# EAGLE design latch3 (EAGLE 8.3.1)
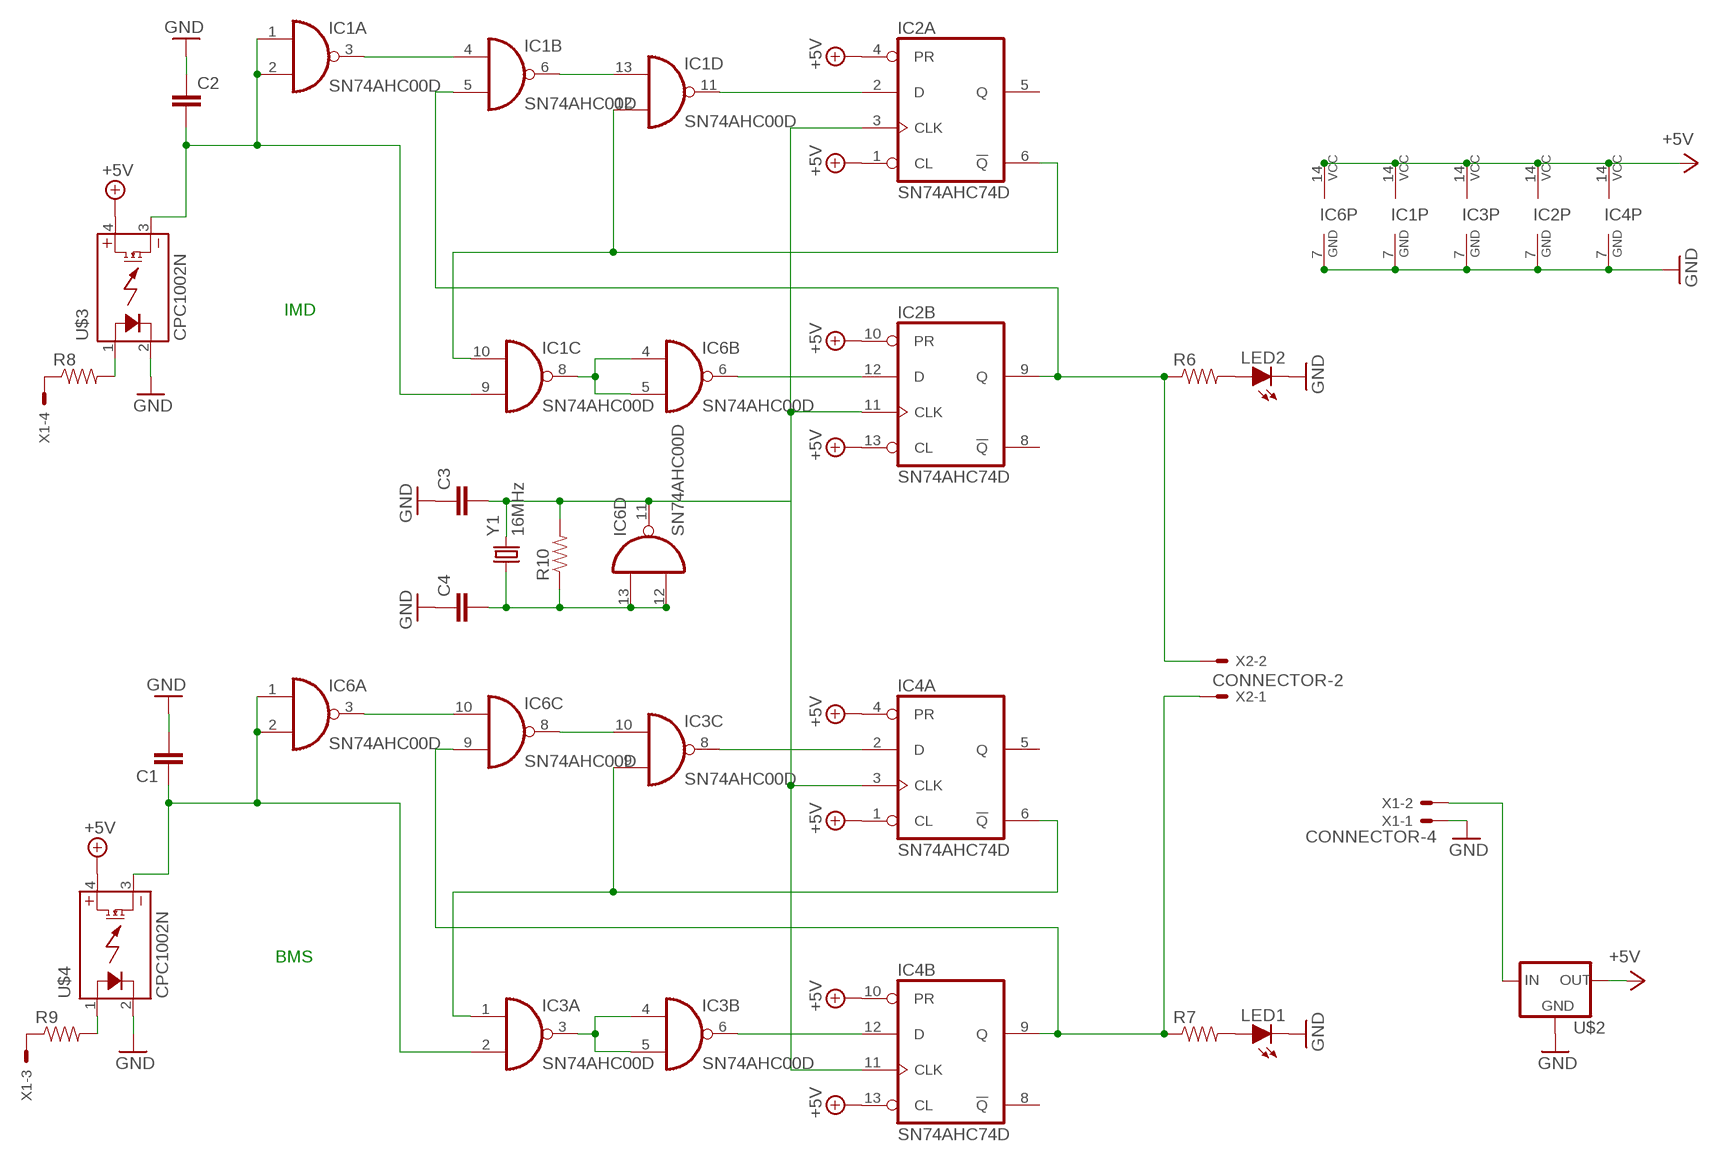
[diagram p0: schematic, sheet 1]

## Parts
C1  CAP0402-CAP  [0402-CAP]
C2  CAP0402-CAP  [0402-CAP]
C3  CAP0402-CAP  [0402-CAP]
C4  CAP0402-CAP  [0402-CAP]
IC1  SN74AHC00D  [SOIC-14]
IC2  SN74AHC74D  [SOIC-14]
IC3  SN74AHC00D  [SOIC-14]
IC4  SN74AHC74D  [SOIC-14]
IC6  SN74AHC00D  [SOIC-14]
LED1  LED-0805  [LED-805]
LED2  LED-0805  [LED-805]
R6  RESISTOR0402  [0402-RES]
R7  RESISTOR0402  [0402-RES]
R8  RESISTOR0402  [0402-RES]
R9  RESISTOR0402  [0402-RES]
R10  RESISTOR0402  [0402-RES]
U$2  5VREG_LM340-NLM340MPX-5.0/NOPB  [SOT223]
U$3  CPC1002N  [SOP04]
U$4  CPC1002N  [SOP04]
X1  CONNECTOR-4  [MINIFIT_5566-4]
X2  CONNECTOR-2  [MINIFIT_5566-2]
Y1  16MHz  CRYSTAL3.2X1.5MM  [CRYSTAL-SMD-3.2X1.5MM]

## Nets
12V: U$2.1(IN) X1.2
+5V: IC1.14(P:VCC) IC2.1(A:CL) IC2.4(A:PR) IC2.10(B:PR) IC2.13(B:CL) IC2.14(P:VCC) IC3.14(P:VCC) IC4.1(A:CL) IC4.4(A:PR) IC4.10(B:PR) IC4.13(B:CL) IC4.14(P:VCC) IC6.14(P:VCC) U$2.3(OUT) U$3.4(DC+) U$4.4(DC+)
BMS_5V: C1.1 IC3.2(A:I1) IC6.1(A:I0) IC6.2(A:I1) U$4.3(DC-)
BMS_IN: R9.2 U$4.1(CONTROL+)
BMS_OUT: IC4.9(B:Q) IC6.9(C:I1) R7.1 X2.1
GND: C1.2 C2.1 C3.1 C4.1 IC1.7(P:GND) IC2.7(P:GND) IC3.7(P:GND) IC4.7(P:GND) IC6.7(P:GND) LED1.C LED2.C U$2.2(GND) U$2.4(GND) U$3.2(CONTROL-) U$4.2(CONTROL-) X1.1
IMD_5V: C2.2 IC1.1(A:I0) IC1.2(A:I1) IC1.9(C:I1) U$3.3(DC-)
IMD_IN: R8.2 U$3.1(CONTROL+)
IMD_OUT: IC1.5(B:I1) IC2.9(B:Q) R6.1 X2.2
N$2: IC1.3(A:O) IC1.4(B:I0)
N$4: IC1.6(B:O) IC1.13(D:I0)
N$5: IC1.10(C:I0) IC1.12(D:I1) IC2.6(A:!Q)
N$6: IC1.11(D:O) IC2.2(A:D)
N$7: C3.2 IC2.3(A:CLK) IC2.11(B:CLK) IC4.3(A:CLK) IC4.11(B:CLK) IC6.11(D:O) R10.2 Y1.P$2
N$8: IC2.12(B:D) IC6.6(B:O)
N$10: IC3.6(B:O) IC4.12(B:D)
N$11: IC1.8(C:O) IC6.4(B:I0) IC6.5(B:I1)
N$12: C4.2 IC6.12(D:I1) IC6.13(D:I0) R10.1 Y1.P$1
N$20: IC6.3(A:O) IC6.10(C:I0)
N$21: IC3.10(C:I0) IC6.8(C:O)
N$22: IC3.1(A:I0) IC3.9(C:I1) IC4.6(A:!Q)
N$23: IC3.8(C:O) IC4.2(A:D)
N$25: IC3.3(A:O) IC3.4(B:I0) IC3.5(B:I1)
N$29: LED1.A R7.2
N$30: LED2.A R6.2
N$32: R8.1 X1.4
N$33: R9.1 X1.3
Unconnected: IC2.5(A:Q) IC2.8(B:!Q) IC3.11(D:O) IC3.12(D:I1) IC3.13(D:I0) IC4.5(A:Q) IC4.8(B:!Q)

## Notes on the sheet
- IMD
- BMS

## Library data of the parts
C1-C4 = HyTechDevices:CAP: Capacitor Standard 0603 ceramic capacitor, and 0.1" leaded capacitor.
IC1 IC3 IC6 = HyTechDevices:SN74AHC00: TI SN74AHC00 Quadruple 2-input NAND
IC2 IC4 = HyTechDevices:SN74AHC74: TI SN74AHC74 Dual positive edge triggered D-type FLIP FLOP
LED1 LED2 = HyTechDevices:LED: Light Emitting Diode (LED) Source: Dangerous Prototypes Eagle Library <https://github.com/DangerousPrototypes/Eagle_Part_Library>
R6-R10 = HyTechDevices:RESISTOR: Resistor Basic schematic elements and footprints for 0603, 1206, and PTH resistors.
U$2 = HyTechDevices:5VREG_LM340-N: Voltage Regulator 5v linear voltage regulator Datasheet <http://www.mouser.com/ProductDetail/Texas-Instruments/LM340MPX-50-NOPB/?qs=X1J7HmVL2ZGZwtTFRQ9ItA%3D%3D> MAX current out: 1.5A MAX voltage in: 35V
U$3 U$4 = HyTechDevices:CPC1002N: IXYS Solid State Relay .7A
X1 = HyTechDevices:CONNECTOR-4: Mini-Fit Junior connector 4 pole Source: http://www.molex.com; OC_FARNELL: unknown; OC_NEWARK: unknown
X2 = HyTechDevices:CONNECTOR-2: Mini-Fit Junior connector 2 pole Source: http://www.molex.com; OC_FARNELL: 1822072; OC_NEWARK: unknown
Y1 = HyTechDevices:CRYSTAL: Various standard crystals. Proven footprints. Source: Sparkfun <https://github.com/sparkfun/SparkFun-Eagle-Libraries>; PROD_ID: XTAL-13062; VALUE: 32.768kHz

## Board
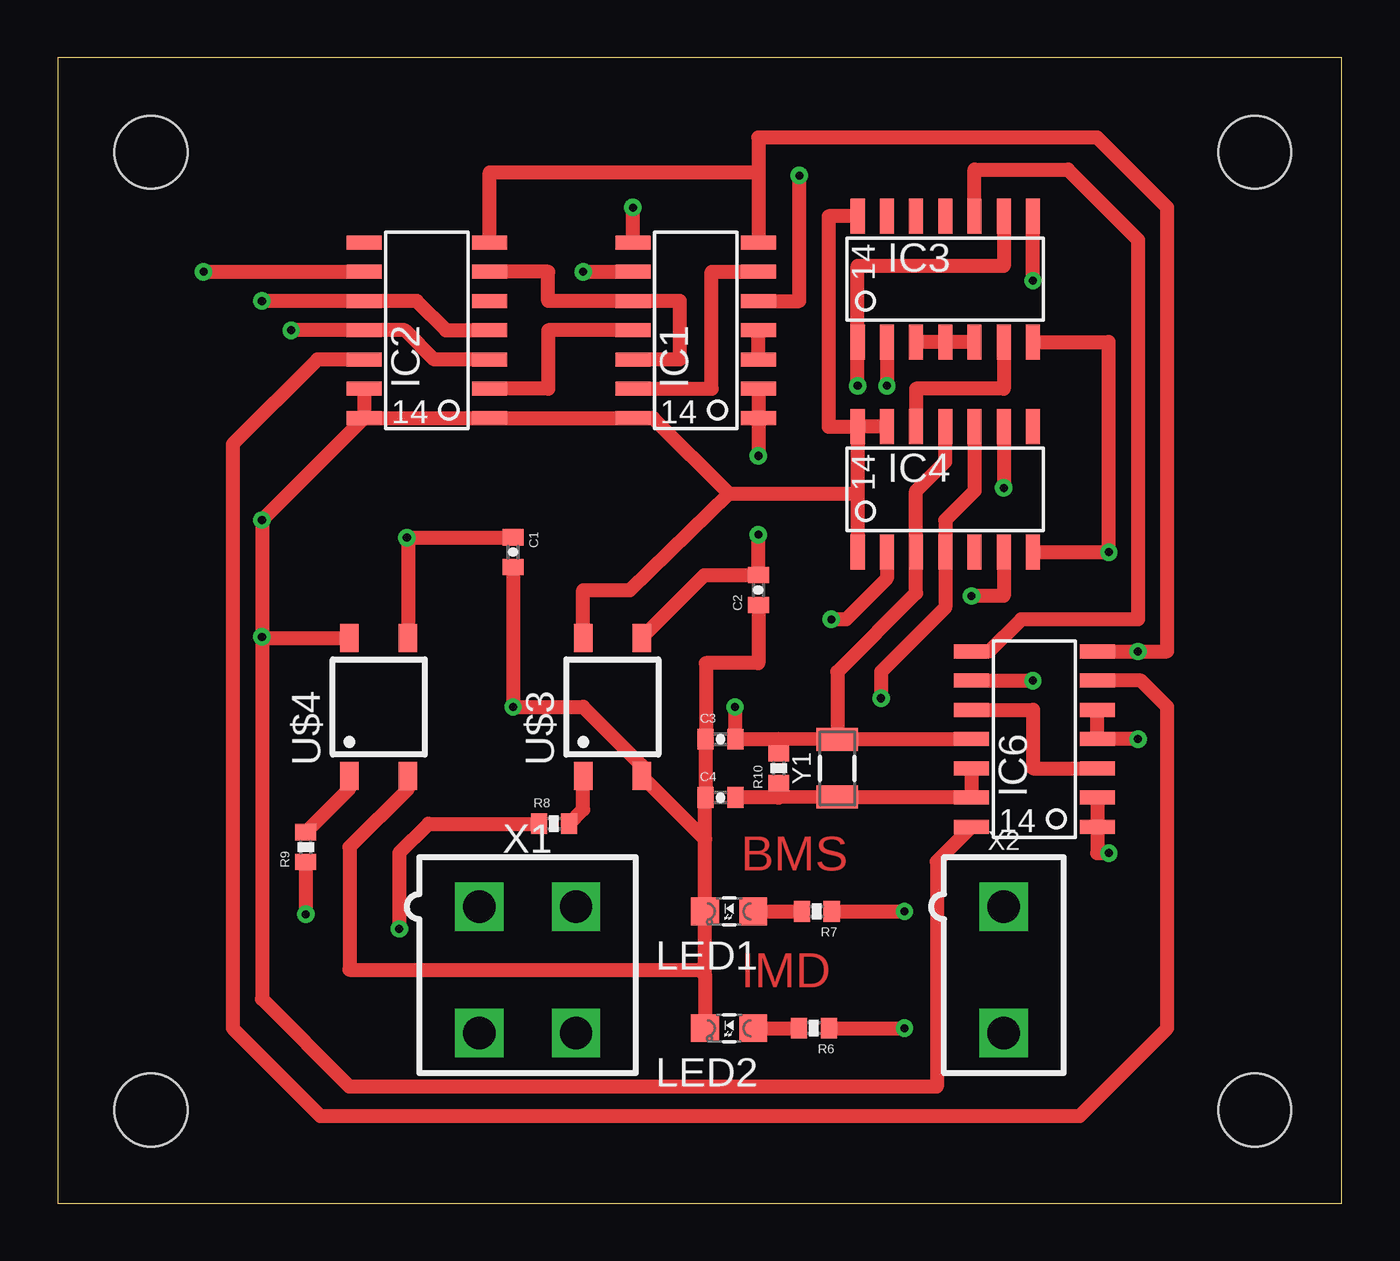
[diagram p1: board, top side]
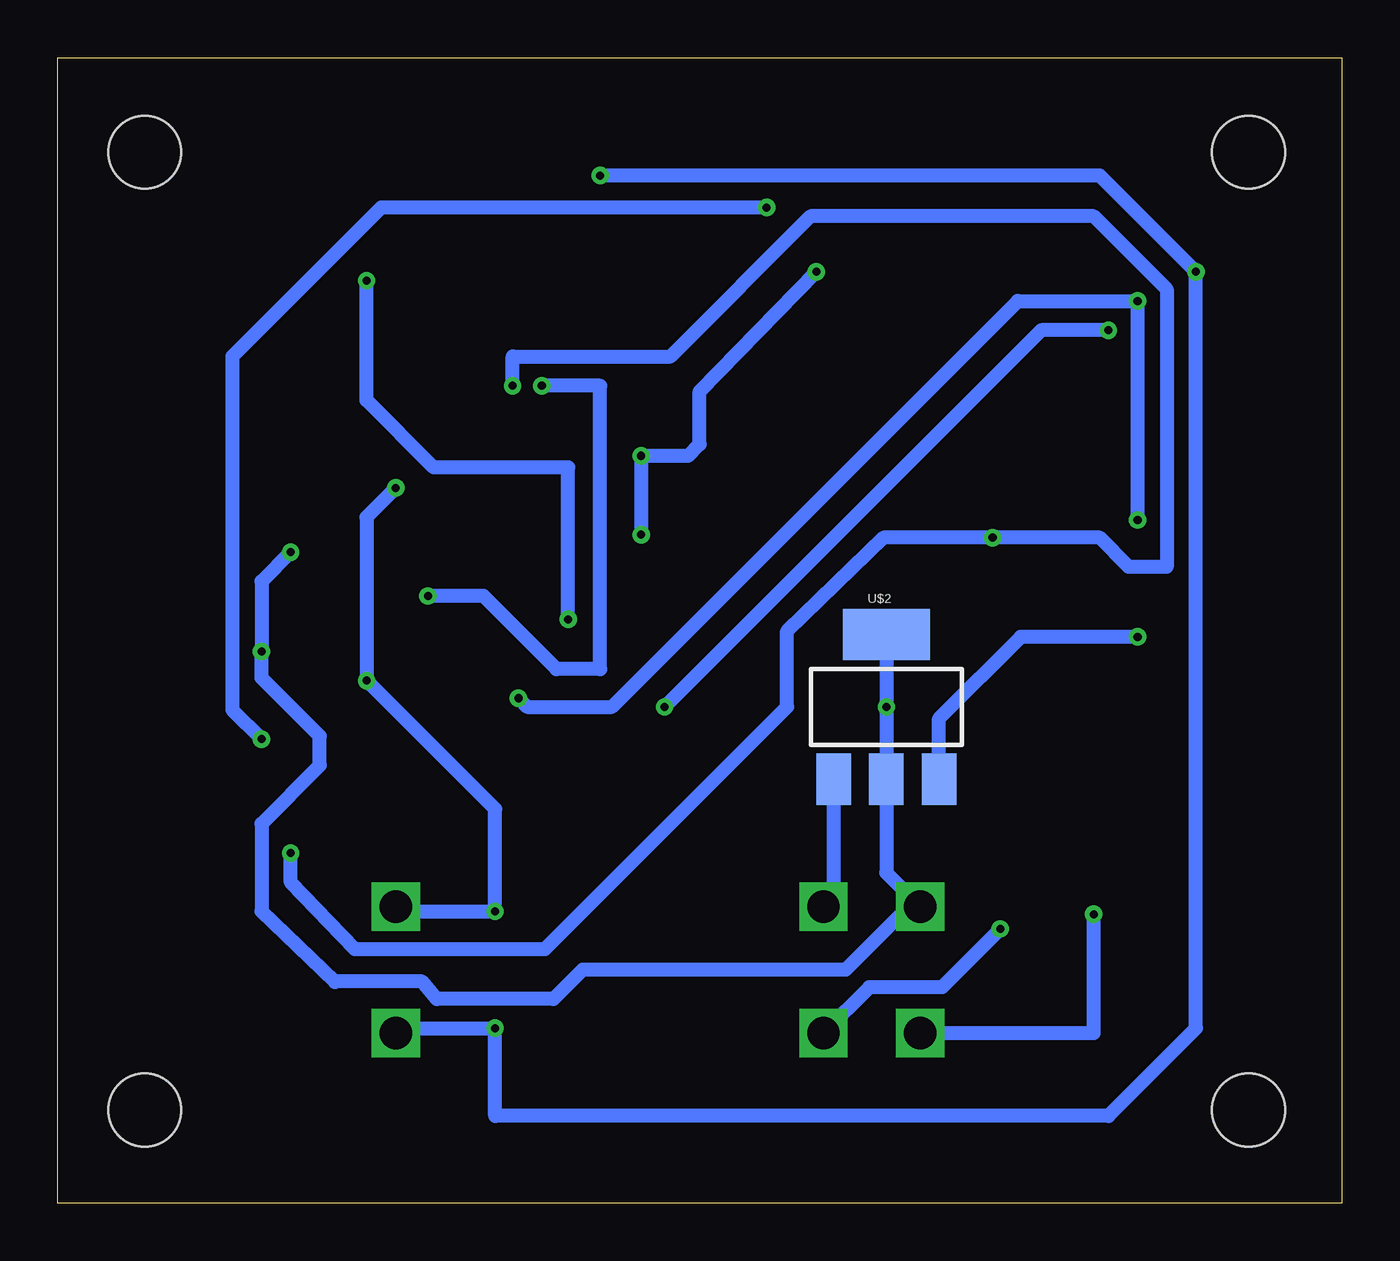
[diagram p2: board, bottom side, seen from below]

Size 55.86 x 49.84 mm. Coordinates in mm from the lower left corner, seen from the top.
Outline: 0,0 55.86,0 55.86,49.84 0,49.84 0,0
Copper layers (1*16): Top 0.035mm / dielectric 1.5mm / Bottom 0.035mm
Design rules "default *": minimum track width 6mil, minimum drill 0.35mm, track to track 16mil, track to pad 16mil, pad to pad 16mil, via to via 16mil, smd to smd 16mil, copper to edge 40mil, drill to drill 6mil, minimum pad ring 10mil, minimum via ring 8mil, stop-mask expansion 4mil, vias tented up to drill 0mil, thermal gap 10mil
Holes 3.17 mm at 4.06,4.06 4.06,45.72 52.07,45.72 52.07,4.06

### Footprints (pad centres in the part's own frame; a part is rotated, then mirrored left to right if it is on the bottom)
0402-CAP = smd 0.7 x 0.9: 1 -0.65,0; 2 0.65,0
SOIC-14 = smd 0.61 x 1.524: 1 -4.445,-2.794; 2 -3.175,-2.794; 3 -1.905,-2.794; 4 -0.635,-2.794; 5 0.635,-2.794; 6 1.905,-2.794; 7 3.175,-2.794; 8 3.175,2.667; 9 1.905,2.667; 10 0.635,2.667; 11 -0.635,2.667; 12 -1.905,2.667; 13 -3.175,2.667; 14 -4.445,2.667
LED-805 = smd 1.2 x 1.2: A 0,-1.05; C 0,1.05
0402-RES = smd 0.7 x 0.9: 1 -0.65,0; 2 0.65,0
SOT223 = smd 1.5 x 2.235: 1 -2.3,-3.15; 2 0,-3.15; 3 2.3,-3.15 | smd 3.8 x 2.2: 4 0,3.15
SOP04 = smd 0.8 x 1.2: 1 -1.27,-3; 2 1.27,-3; 3 1.27,3; 4 -1.27,3
MINIFIT_5566-4 = drill 1.4 square: 1 2.1,-2.75; 2 -2.1,-2.75; 3 2.1,2.75; 4 -2.1,2.75
MINIFIT_5566-2 = drill 1.4 square: 1 0,-2.75; 2 0,2.75
CRYSTAL-SMD-3.2X1.5MM = smd 1 x 1.8: P$1 -1.25,0; P$2 1.25,0

### Placement (x,y rotation side)
C1  19.81,28.32 270 top
C2  30.48,26.67 90 top
C3  28.83,20.19 0 top
C4  28.83,17.65 0 top
IC1  27.69,38.61 90 top
IC2  16,38.61 90 top
IC3  39.24,40.26 0 top
IC4  39.24,31.11 0 top
IC6  42.42,20.83 90 top
LED1  29.21,12.7 90 top
LED2  29.21,7.62 90 top
R6  32.89,7.62 180 top
R7  33.02,12.7 180 top
R8  21.59,16.51 0 top
R9  10.79,15.49 90 top
R10  31.37,18.92 90 top
U$2  19.81,21.59 0 bottom
U$3  24.13,21.59 0 top
U$4  13.97,21.59 0 top
X1  20.45,10.16 180 top
X2  41.15,10.16 180 top
Y1  33.91,18.92 90 top

### Tracks (layer width: path | path; a pad name or v marks a point on that pad's centre or on a via)
12V
  Bottom 0.61: U$2.1 22.11,13.35 X1.2
+5V  (via drill 0.35)
  Top 0.61: 8.89,24.59 U$4.4 | 8.89,24.59 v8.89,24.64 v8.89,29.72 IC2.14 | 22.81,24.64 U$3.4 22.86,26.67 24.89,26.67 29.21,30.86 | IC4.13 IC4.14 | IC2.13 IC2.14 | IC2.4 16.89,37.97 15.62,39.24 IC2.10 v8.89,39.24 | IC2.14 IC2.1 IC1.14 25.91,34.16 29.21,30.86 | IC3.14 33.53,42.93 33.53,33.78 IC4.14 | IC4.10 39.88,30.99 38.61,29.72 IC4.4 38.61,25.91 35.81,23.11 v35.81,21.97 | 8.89,24.59 8.89,8.89 12.7,5.08 38.24,5.08 38.24,14.87 IC6.14 | IC4.14 34.8,30.86 | 34.8,30.86 IC4.1 | 29.21,30.86 34.8,30.86
  Bottom 0.61: v8.89,24.64 13.97,24.64 17.53,21.08 17.53,18.45 U$2.3 | v8.89,29.72 v8.89,39.24 14.1,39.24 31.75,21.59 35.43,21.59 v35.81,21.97
BMS_5V  (via drill 0.35)
  Top 0.61: IC3.2 v36.07,35.56 | IC6.2 IC6.1 45.21,15.24 v45.72,15.24 | v15.19,28.96 15.22,28.96 15.24,28.94 | 15.24,28.94 U$4.3 | C1.1 19.78,28.94 15.24,28.94
  Bottom 0.61: v45.72,15.24 45.72,13.97 42.93,11.05 34.67,11.05 24.13,21.59 24.13,24.89 19.94,28.96 v15.19,28.96 10.54,28.96 9.27,27.69 7.62,27.69 7.62,39.75 10.79,42.93 23.11,42.93 29.21,36.83 36.07,36.83 v36.07,35.56
BMS_IN
  Top 0.61: U$4.1 12.7,18.05 R9.2
BMS_OUT  (via drill 0.35)
  Top 0.61: R7.1 v36.83,12.7 | IC4.9 v41.15,31.11 | IC6.9 v42.42,22.73
  Bottom 0.61: X2.1 40.94,12.7 v36.83,12.7 36.83,17.14 v42.42,22.73 42.42,29.84 v41.15,31.11
GND  (via drill 0.35)
  Top 0.61: 28.16,9.92 LED1.C 28.16,15.83 | 28.16,9.92 LED2.C | 28.16,15.83 U$3.2 25.4,19.05 22.86,21.59 v19.81,21.59 C1.2 | 28.18,17.67 C3.1 28.19,20.19 28.19,23.5 30.48,23.5 C2.1 | 28.18,17.67 C4.1 | 28.16,15.83 28.16,17.53 28.18,17.67 | U$4.2 15.24,18.03 12.7,15.49 12.7,10.16 27.92,10.16 28.16,9.92 | IC3.7 45.72,37.47 v45.72,28.32 IC4.7 | IC6.7 v46.99,24 48.26,24 48.26,43.31 45.21,46.35 30.48,46.35 30.48,44.83 | IC2.7 18.8,44.83 30.48,44.83 | 30.48,44.83 IC1.7
  Bottom 0.61: U$2.4 v19.81,21.59 U$2.2 19.81,14.38 X1.1 18.84,12.91 21.59,10.16 33.02,10.16 34.29,8.89 39.37,8.89 40.01,9.65 43.77,9.65 43.79,9.63 46.99,12.7 46.99,16.51 44.45,19.05 44.45,20.32 46.99,22.86 v46.99,24 46.99,27.05 v45.72,28.32
IMD_5V  (via drill 0.35)
  Top 0.61: 25.41,24.59 U$3.3 | U$3.3 25.4,24.64 | 25.41,24.88 25.41,24.59 | 25.46,24.64 25.41,24.59 | U$3.3 26.44,25.63 | 26.44,25.63 26.83,26.02 | v22.86,40.51 IC1.9 | IC1.2 IC1.1 v30.48,32.51 | v30.48,29.08 C2.2 28.13,27.32 26.44,25.63
  Bottom 0.61: v22.86,40.51 27.94,35.31 27.94,33.02 28.45,32.51 v30.48,32.51 v30.48,29.08
IMD_IN
  Top 0.61: R8.2 22.86,17.13 U$3.1
IMD_OUT  (via drill 0.35)
  Top 0.61: R6.1 v36.83,7.62 | v6.35,40.51 IC2.9 | IC1.5 32.26,39.24 v32.26,44.7
  Bottom 0.61: X2.2 41.15,7.62 v36.83,7.62 36.83,3.81 10.16,3.81 6.35,7.62 v6.35,40.51 10.54,44.7 v32.26,44.7
N$2
  Top 0.61: IC1.3 IC1.4
N$4
  Top 0.61: IC1.13 28.45,35.43 28.45,40.51 IC1.6
N$5
  Top 0.61: IC1.12 27.05,36.7 27.05,39.24 IC1.10 21.34,39.24 21.34,40.51 IC2.6
N$6
  Top 0.61: IC1.11 21.34,37.97 21.34,35.43 IC2.2
N$7  (via drill 0.35)
  Top 0.61: 31.35,20.19 C3.2 29.46,20.21 v29.46,21.59 | 33.77,20.17 31.35,20.19 | 33.77,20.17 Y1.P$2 33.91,20.19 IC6.11 | 31.35,20.19 31.37,20.19 R10.2 | IC2.3 16.38,36.7 15.11,37.97 IC2.11 v10.16,37.97 | 33.77,20.17 33.91,20.31 33.91,23.11 37.34,26.54 IC4.3 37.34,30.99 38.61,32.26 IC4.11
  Bottom 0.61: v10.16,37.97 13.08,37.97 v29.46,21.59
N$8
  Top 0.61: IC6.6 47.12,22.73 48.26,21.59 48.26,7.62 44.45,3.81 11.43,3.81 7.62,7.62 7.62,33.02 11.3,36.7 IC2.12
N$10
  Top 0.61: IC3.6 41.15,35.43 37.34,35.43 IC4.12
N$11  (via drill 0.35)
  Top 0.61: IC6.5 IC6.4 v46.99,20.19 | IC1.8 v25.02,43.31
  Bottom 0.61: v25.02,43.31 41.78,43.31 48.26,36.83 48.26,21.46 v46.99,20.19
N$12
  Top 0.61: 31.35,17.65 C4.2 | R10.1 31.37,17.65 31.35,17.65 | 31.35,17.65 Y1.P$1 33.91,17.65 IC6.13 IC6.12
N$20
  Top 0.61: IC6.10 42.42,21.46 42.42,18.92 IC6.3
N$21
  Top 0.61: IC3.10 39.88,44.96 43.94,44.96 46.99,41.91 46.99,25.4 41.91,25.4 40.51,24 IC6.8
N$22  (via drill 0.35)
  Top 0.61: IC3.9 41.15,40.77 34.8,40.77 IC3.1 v34.8,35.56 | IC4.6 41.15,26.42 v39.75,26.42
  Bottom 0.61: v34.8,35.56 32.26,35.56 32.26,23.24 34.16,23.24 37.34,26.42 v39.75,26.42
N$23  (via drill 0.35)
  Top 0.61: IC4.2 36.07,27.18 34.29,25.4 v33.66,25.4 | v42.42,40.13 IC3.8
  Bottom 0.61: v33.66,25.4 33.66,32 39.5,32 42.42,34.92 v42.42,40.13
N$25
  Top 0.61: IC3.3 IC3.4 IC3.5
N$29
  Top 0.61: LED1.A R7.2
N$30
  Top 0.61: LED2.A R6.2
N$32  (via drill 0.35)
  Top 0.61: v14.86,11.94 14.86,15.24 16.13,16.51 R8.1
  Bottom 0.61: X1.4 20.56,9.4 17.4,9.4 v14.86,11.94
N$33  (via drill 0.35)
  Top 0.61: v10.78,12.57 v10.79,12.57 R9.1
  Bottom 0.61: X1.3 10.79,7.41 v10.79,12.57

### Text on the board
Top: BMS | IMD